# EAGLE design Pointcast_upper_board_V1.02 (EAGLE 7.2.0)
DESIGNER: Rob Oudendijk; VERSION: V1.02
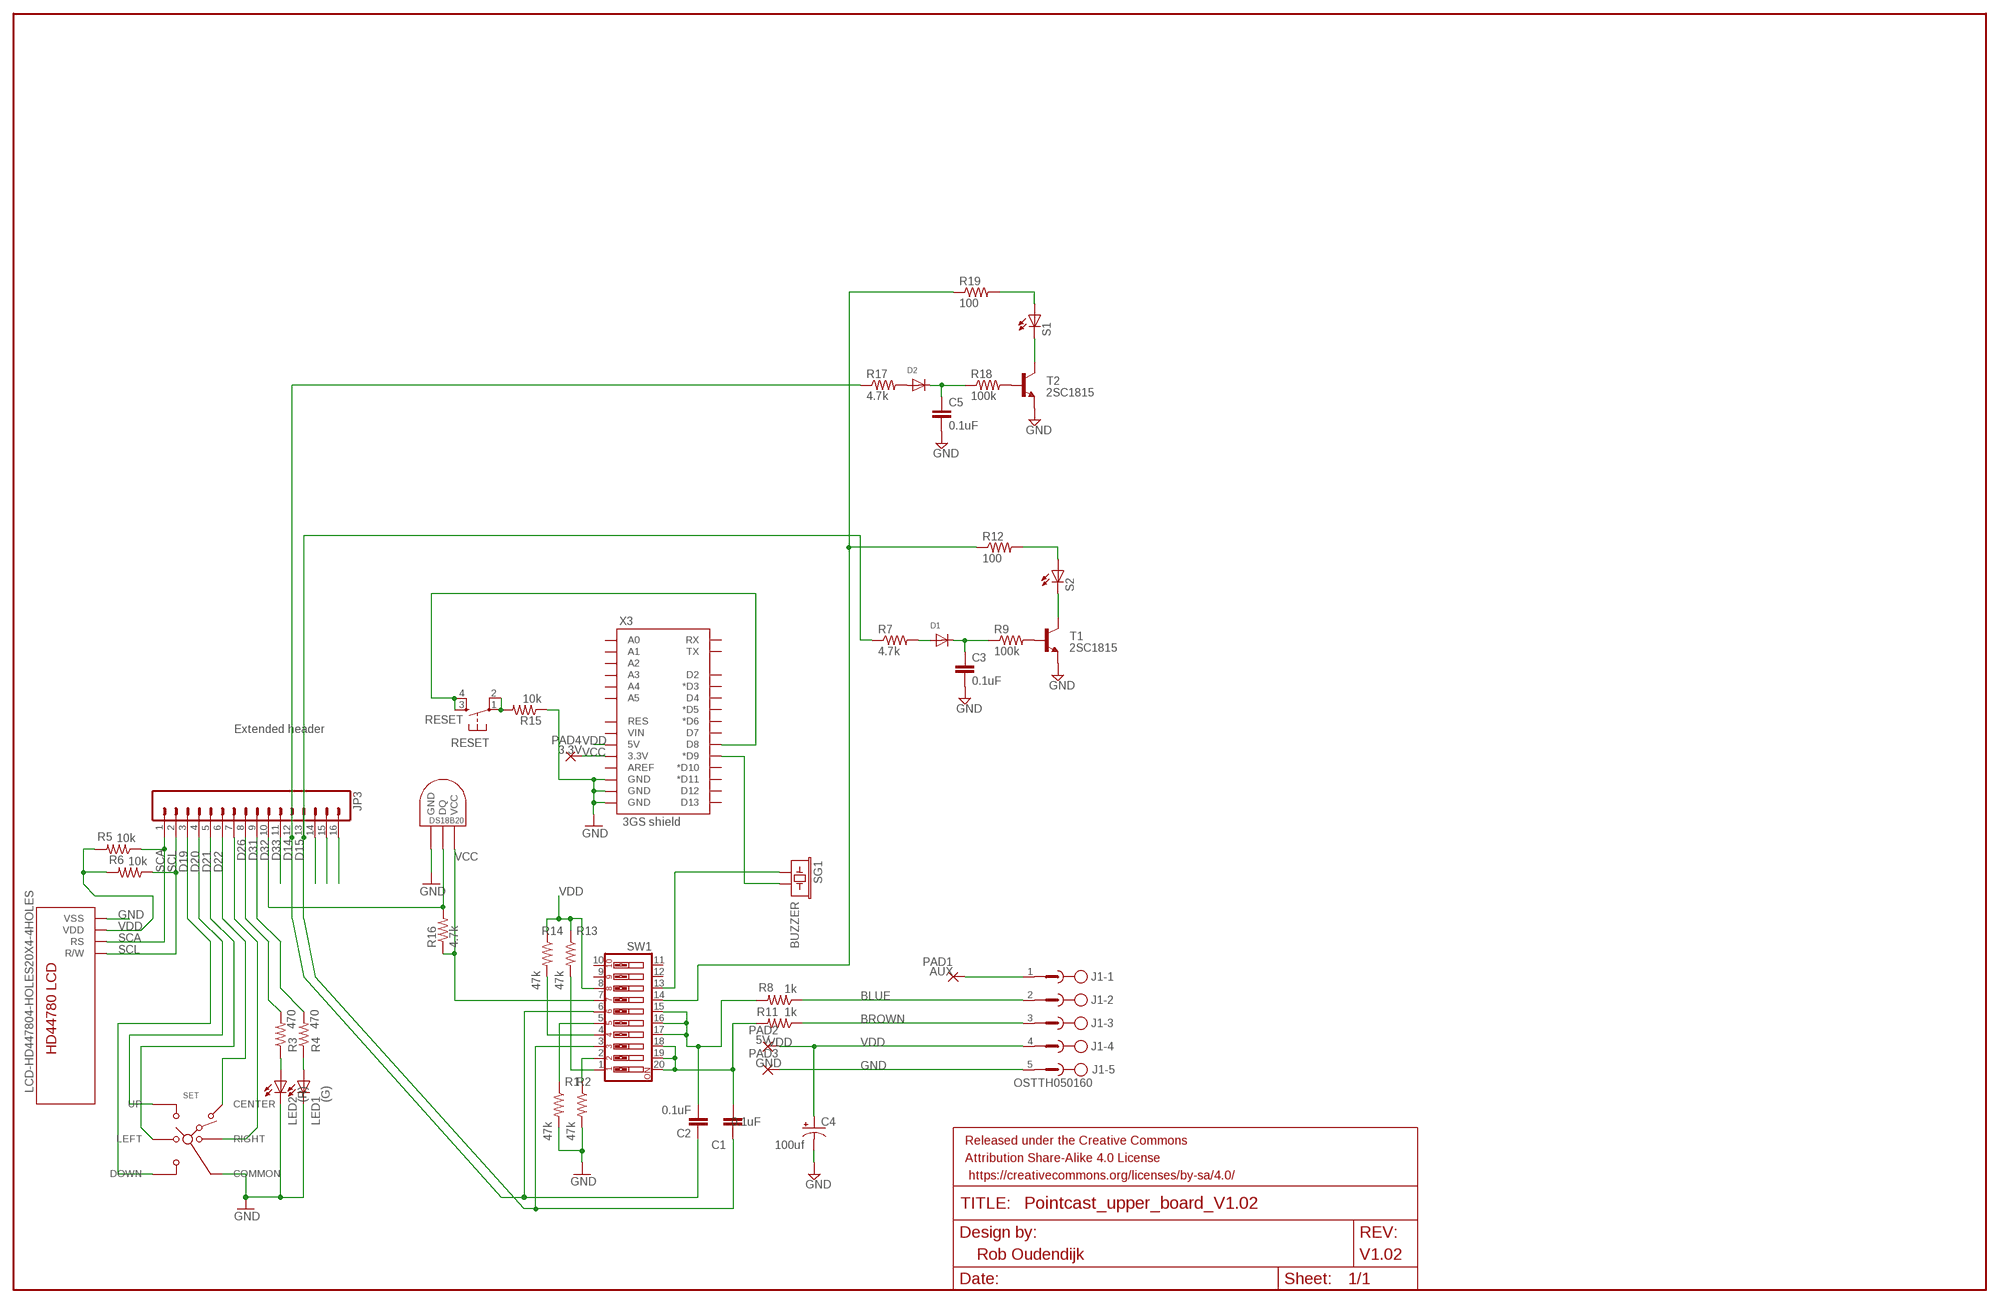
[diagram p0: schematic, sheet 1]

## Parts
C1  0.1uF  C-EU025-024X044  [C025-024X044]
C2  0.1uF  C-EU025-024X044  [C025-024X044]
C3  0.1uF  C-EU025-024X044  [C025-024X044]
C4  100uf  CAP_POLPTH1  [CPOL-RADIAL-100UF-25V]
C5  0.1uF  C-EU025-024X044  [C025-024X044]
D1  DIODEDIODE_BIG  [DO41-10]
D2  DIODEDIODE_BIG  [DO41-10]
FRAME1  FRAME-LEDGER  [CREATIVE_COMMONS]
J1  OSTTH050160  [EDSTL130-05]
JP3  Extended header  M16PTH  [1X16]
LED1  (G)  LED3MM  [LED3MM]
LED2  (R)  LED3MM  [LED3MM]
PAD1  AUX  2,15/1,0  [2,15/1,0]
PAD2  5V  2,15/1,0  [2,15/1,0]
PAD3  GND  2,15/1,0  [2,15/1,0]
PAD4  3.3V  2,15/1,0  [2,15/1,0]
R1  47k  R-US_0207/10  [0207/10]
R2  47k  R-US_0207/10  [0207/10]
R3  470  R-US_0207/10  [0207/10]
R4  470  R-US_0207/10  [0207/10]
R5  10k  R-US_0207/10  [0207/10]
R6  10k  R-US_0207/10  [0207/10]
R7  4.7k  R-US_0207/10  [0207/10]
R8  1k  R-US_0207/10  [0207/10]
R9  100k  R-US_0207/10  [0207/10]
R11  1k  R-US_0207/10  [0207/10]
R12  100  R-US_0207/10  [0207/10]
R13  47k  R-US_0207/10  [0207/10]
R14  47k  R-US_0207/10  [0207/10]
R15  10k  R-US_0207/10  [0207/10]
R16  4.7k  R-US_0207/10  [0207/10]
R17  4.7k  R-US_0207/10  [0207/10]
R18  100k  R-US_0207/10  [0207/10]
R19  100  R-US_0207/10  [0207/10]
RESET  RESET  DTS-6  [DTS-6]
S1  LED3MM  [LED3MM]
S2  LED3MM  [LED3MM]
SET  SKQUCAA010  [SKQU]
SG1  BUZZER  BUZZERPTH  [BUZZER-12MM]
SW1  SW_DIP-10  [EDG-10]
T1  2SC1815  [TO92-ECB]
T2  2SC1815  [TO92-ECB]
TEMP  AVA_DS1820TO92  [AVA_DS1820]
X1  LCD-HD447804-HOLES20X4-4HOLES  [LCD-20X4-4HOLES]
X3  3GS shield  ARDUINO_SHIELDLABEL  [DUEMILANOVE_SHIELD]

## Nets
BLUE: J1.2 R8.1
BROWN: J1.3 R11.1
D14: C2.1 JP3.12 R17.1 SW1.6
D15: C1.1 JP3.13 R7.1 SW1.3
D19: JP3.3 SET.DOWN
D20: JP3.4 SET.UP
D21: JP3.5 SET.LEFT
D22: JP3.6 SET.CENTER
D26: JP3.8 R3.2
D31: JP3.9 R4.2
D32: JP3.10 R16.2 TEMP.DQ
D33: JP3.11
GND [PWP]: C3.2 C4.1(-) C5.2 J1.5 LED1.K(C) LED2.K(C) PAD3.1(P) R1.2 R2.2 R15.1 SET.COMMON T1.E T2.E TEMP.GND X1.P$13(VSS) X3.GND@0(GND) X3.GND@1(GND) X3.GND@2(GND)
N$1: SG1.+ SW1.13
N$2: JP3.14
N$3: LED2.A R3.1
N$4: JP3.15
N$6: R14.2 SW1.4
N$7: R12.1 R19.1 SW1.14
N$8: R2.1 SW1.2
N$9: R1.1 SW1.5
N$10: J1.1 PAD1.1(P)
N$23: SG1.- X3.D9(*D9)
N$39: C1.2 R11.2 SW1.18 SW1.19 SW1.20
N$43: R13.2 SW1.1
N$54: D1.A R7.2
N$58: C3.1 D1.C R9.1
N$62: LED1.A R4.1
N$76: R9.2 T1.B
N$77: S2.K(C) T1.C
N$84: R15.2 RESET.1 RESET.2
N$85: RESET.3 RESET.4 X3.D8
N$92: R12.2 S2.A
N$136: D2.A R17.2
N$137: C5.1 D2.C R18.1
N$138: R18.2 T2.B
N$139: S1.K(C) T2.C
N$140: R19.2 S1.A
N$223: C2.2 R8.2 SW1.15 SW1.16 SW1.17
N$244: JP3.16
S$5: JP3.7 SET.RIGHT
SCA: JP3.1 R5.1 X1.P$15(RS)
SCL: JP3.2 R6.1 X1.P$16(R/W)
VCC [PWP]: PAD4.1(P) R16.1 SW1.7 TEMP.VDD(VCC) X3.3.3V
VDD [PWP]: C4.2(+) J1.4 PAD2.1(P) R5.2 R6.2 R13.1 R14.1 SW1.8 X1.P$14(VDD) X3.5V
Unconnected: SW1.9 SW1.10 SW1.11 SW1.12 X3.A0 X3.A1 X3.A2 X3.A3 X3.A4 X3.A5 X3.AREF X3.D2 X3.D3(*D3) X3.D4 X3.D5(*D5) X3.D6(*D6) X3.D7 X3.D10(*D10) X3.D11(*D11) X3.D12 X3.D13 X3.RES X3.RX X3.TX X3.VIN

## Library data of the parts
C1-C3 C5 = rcl:C-EU: CAPACITOR, European symbol
C4 = SparkFun-Capacitors:CAP_POL: Capacitor Polarized These are standard SMD and PTH capacitors. Normally 10uF, 47uF, and 100uF in electrolytic and tantalum varieties. Always verify the external diameter of the through hole cap, it varies with capacity, voltage, and manufacturer. The EIA devices should be standard.
D1 D2 = adafruit:DIODE: Diode SMADIODE - SMA Surface Mount Package 20V 1A Schottky Diode Digikey: 641-1014-6-ND DO-1N4148 - Through Hole Small Current Diode SOD-123 20V 1 A (.5mV Vf) Schottky Diode - Digikey: MBRX120TPMSCT-ND SOD-323 10V 570mA (.38mV Vf, 3ns) Schottky Diode - Digikey: ZLLS410CT-ND SOD-523 30V 30mA Schottky Diode (RB751S-40TE61) - Digikey: RB751S-40TE61CT-ND SOT23-R/W - SOT23 Package (R = Solder Paste/Reflow Ovens, W = Hand-Soldering) BAT54Film 40V 300mA - Digikey: 497-7162-1-ND
FRAME1 = SparkFun-Aesthetics:FRAME-LEDGER: Schematic Frame Standard 11x14 US Ledger frame
J1 = con-ost:OSTTH050160: 5mm Terminal Header
JP3 = SparkFun-Connectors:M16: 1x16 .1" header
LED1 LED2 S1 S2 = adafruit:LED: LED OSRAM: - CHIPLED LG R971, LG N971, LY N971, LG Q971, LY Q971, LO R971, LY R971 LH N974, LH R974 LS Q976, LO Q976, LY Q976 LO Q996 - Hyper CHIPLED LW Q18S LB Q993, LB Q99A, LB R99A - SideLED LS A670, LO A670, LY A670, LG A670, LP A670 LB A673, LV A673, LT A673, LW A673 LH A674 LY A675 LS A676, LA A676, LO A676, LY A676, LW A676 LS A679, LY A679, LG A679 - Hyper Micro SIDELED® LS Y876, LA Y876, LO Y876, LY Y876 LT Y87S - SmartLED LW L88C, LW L88S LB L89C, LB L89S, LG L890 LS L89K, LO L89K, LY L89K LS L896, LA L896, LO L896, LY L896 - TOPLED LS T670, LO T670, LY T670, LG T670, LP T670 LSG T670, LSP T670, LSY T670, LOP T670, LYG T670 LG T671, LOG T671, LSG T671 LB T673, LV T673, LT T673, LW T673 LH T674 LS T676, LA T676, LO T676, LY T676, LB T676, LH T676, LSB T676, LW T676 LB T67C, LV T67C, LT T67C, LS T67K, LO T67K, LY T67K, LW E67C LS E67B, LA E67B, LO E67B, LY E67B, LB E67C, LV E67C, LT E67C LW T67C LS T679, LY T679, LG T679 LS T770, LO T770, LY T770, LG T770, LP T770 LB T773, LV T773, LT T773, LW T773 LH T774 LS E675, LA E675, LY E675, LS T675 LS T776, LA T776, LO T776, LY T776, LB T776 LHGB T686 LT T68C, LB T68C - Hyper Mini TOPLED® LB M676 - Mini TOPLED Santana® LG M470 LS M47K, LO M47K, LY M47K Source: http://www.osram.convergy.de/
PAD1-PAD4 = wirepad:2,15/1,0: THROUGH-HOLE PAD
R1-R4 R8 R11 R13-R16 = resistor:R-US_: RESISTOR, American symbol
R5 R6 = adafruit:R-US_: RESISTOR, American symbol
R7 R9 R12 R17-R19 = rcl:R-US_: RESISTOR, American symbol
RESET = switch-tact:DTS-6
SET = joy_switch:SKQU: Multi Control Devices TACT Switch - 4-directional with Center Push Type. SKQU Series.; MF: ALPS; OC_ADAFRUIT: 504; OC_MOUSER: 688-SKQUCA; OC_NEWARK: 59M1983
SG1 = SparkFun:BUZZER: Buzzer 12mm Spark Fun Electronics SKU : Comp-Buzzer
SW1 = special:SW_DIP-10: DIP SWITCH
T1 T2 = transistor:2SC1815: NPN EPITAXIAL TRANSISTOR Source: TOSHIBA .. 2SC1815 1.pdf
TEMP = nGeigie_upper_boardTeensy 3Gshield upper board V0.98:AVA_DS1820: DS18B20 Programmable Resolution 1-Wire Digital Thermometer Description The DS18B20 digital thermometer provides 9-bit to 12-bit Celsius temperature measurements and has an alarm function with nonvolatile user-programmable upper and lower trigger points. The DS18B20 communicates over a 1-Wire® bus that by definition requires only one data line (and ground) for communication with a central microprocessor. It has an operating temperature range of -55°C to +125°C and is accurate to ±0.5°C over the range of -10°C to +85°C. In addition, the DS18B20 can derive power directly from the data line ("parasite power"), eliminating the need for an external power supply. Each DS18B20 has a unique 64-bit serial code, which allows multiple DS18B20s to function on the same 1-Wire bus. Thus, it is simple to use one microprocessor to control many DS18B20s distributed over a large area. Applications that can benefit from this feature include HVAC environmental controls, temperature monitoring systems inside buildings, equipment, or machinery, and process monitoring and control systems.
X1 = LCD204_I2C:LCD-HD44780
X3 = SparkFun-Boards:ARDUINO_SHIELD: Arduino shield footprint

## Net classes
0 default: width 0.406 mm, drill 0.254 mm, clearance 0.305 mm
1 PWP: width 0.813 mm, drill 0.254 mm, clearance 0.305 mm

## Board
nGeigie V2.0 Upper board V1.0.0
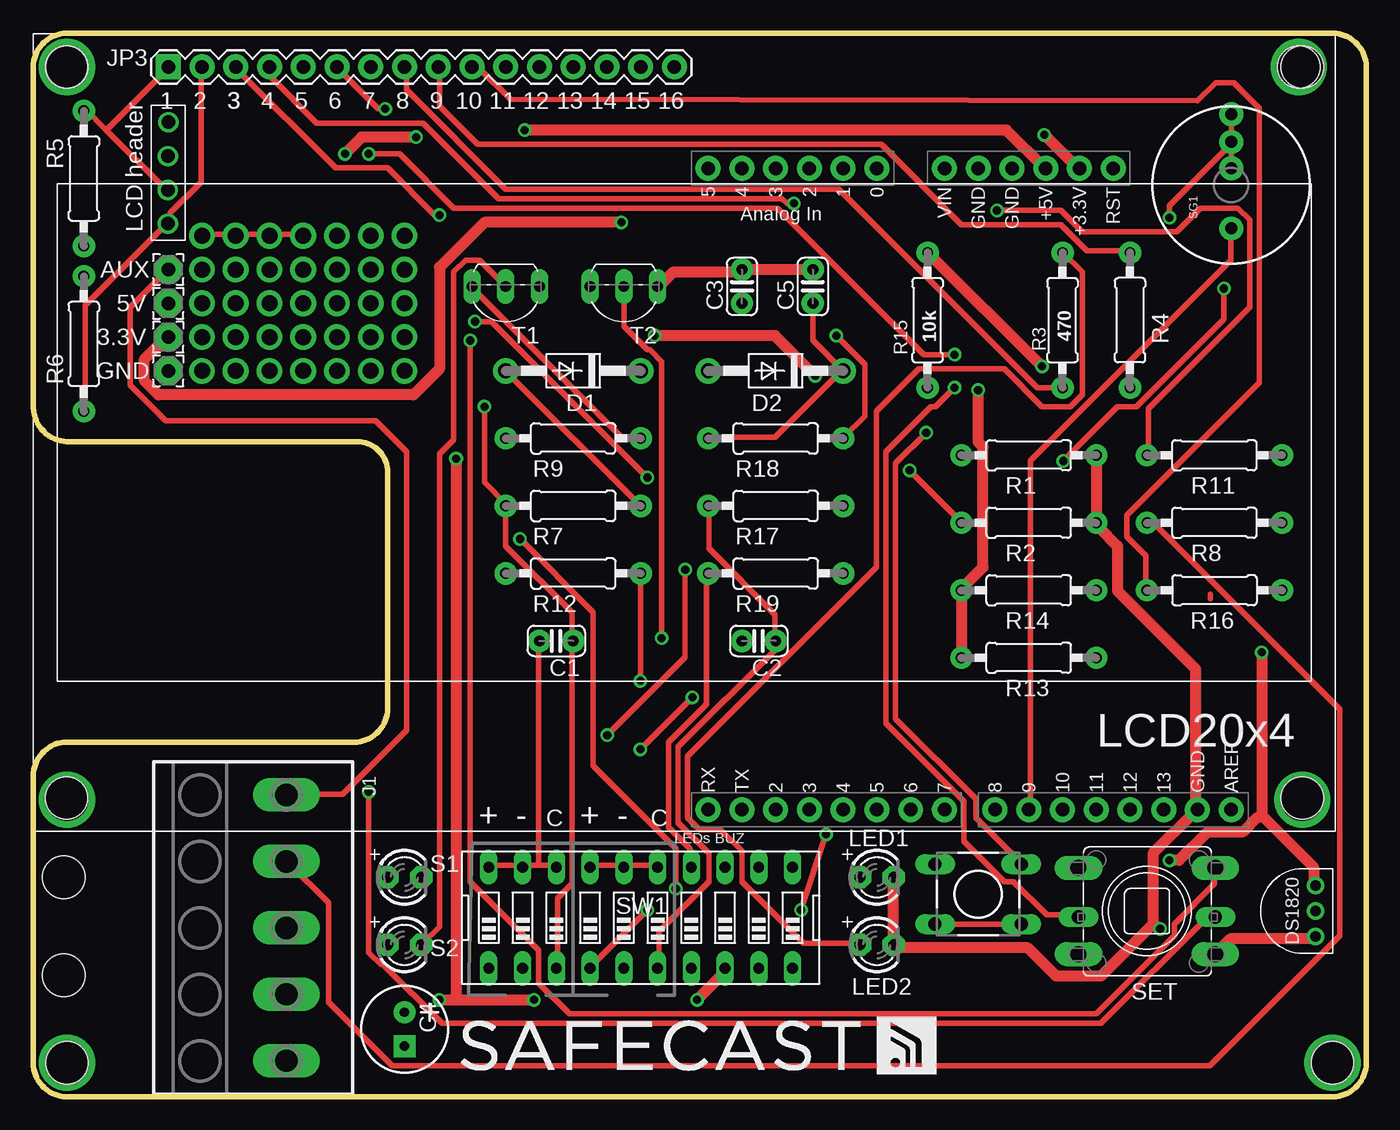
[diagram p1: board, top side]
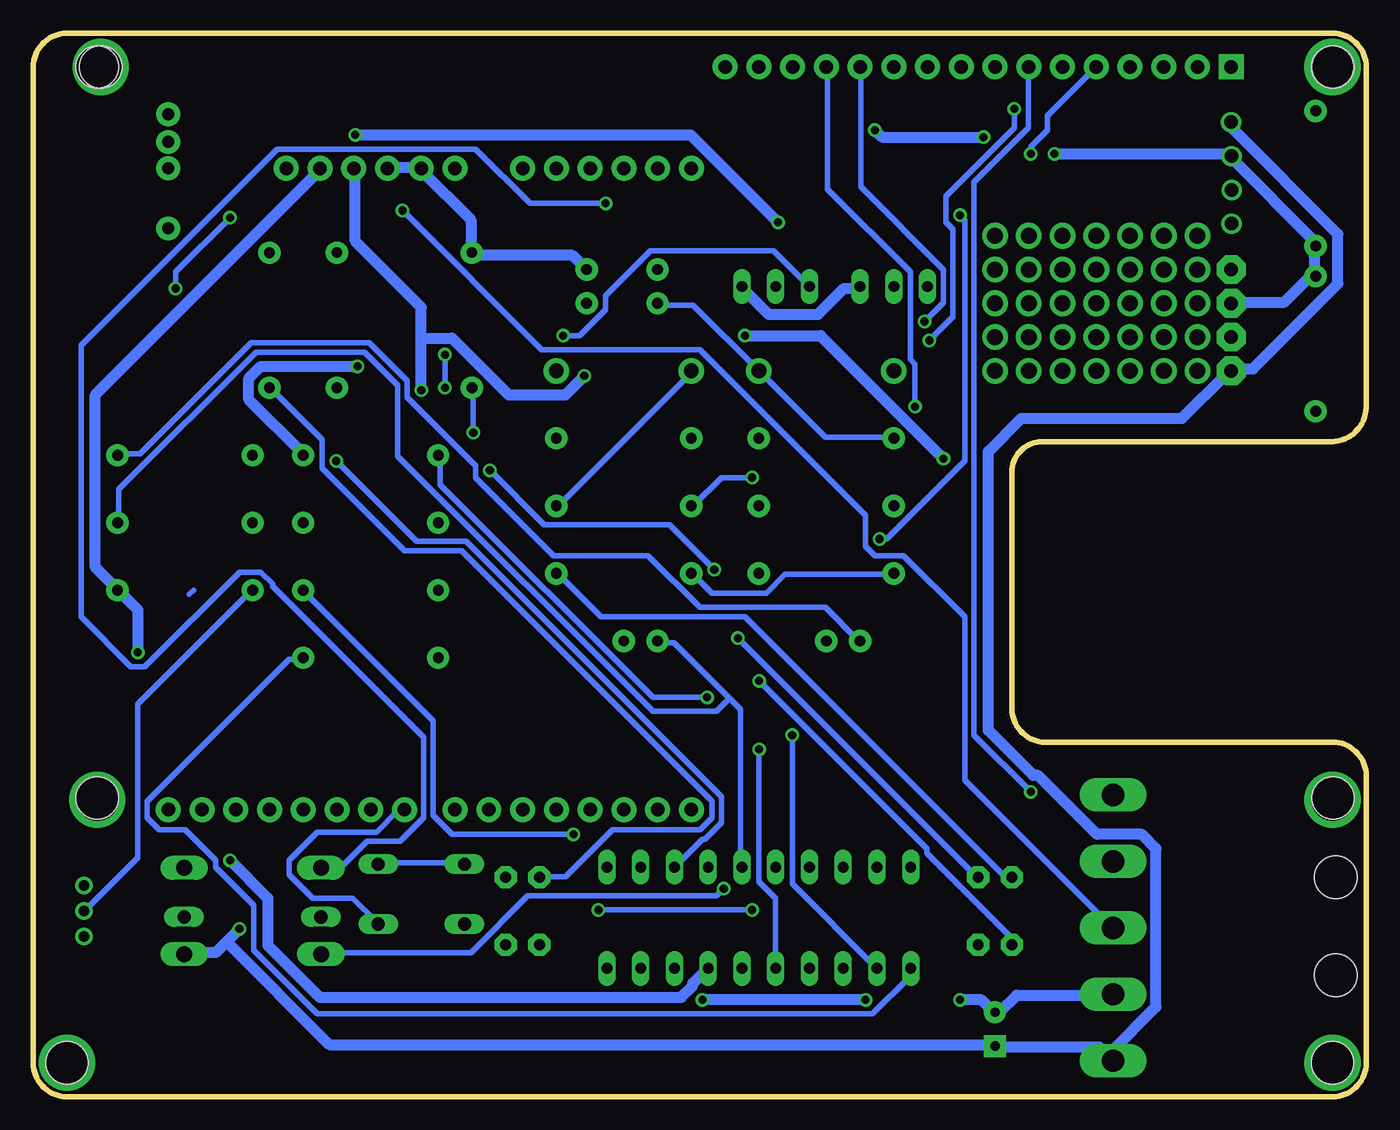
[diagram p2: board, bottom side, seen from below]

Size 100.33 x 80.01 mm. Coordinates in mm from the lower left corner, seen from the top.
Outline: 0,77.47 arc-90 2.54,80.01 97.79,80.01 arc-90 100.33,77.47 100.33,2.54 arc-90 97.79,0 2.54,0 arc-90 0,2.54 0,24.13 arc-90 2.54,26.67 24.13,26.67 arc90 26.67,29.21 26.67,46.99 arc90 24.38,49.28 2.54,49.28 arc-90 0,52.07 0,77.47
Copper layers (1*16): Top 0.035mm / dielectric 1.5mm / Bottom 0.035mm
Design rules "default": minimum track width 10mil, minimum drill 24mil, track to track 8mil, track to pad 8mil, pad to pad 8mil, via to via 8mil, smd to smd 8mil, copper to edge 40mil, drill to drill 8mil, minimum pad ring 10mil, minimum via ring 8mil, stop-mask expansion 4mil, vias tented up to drill 0mil, thermal gap 10mil
Holes 3.2 mm at 2.54,2.54 97.79,2.54 2.54,77.47 95.25,77.47 2.29,9.14 2.29,16.51 2.54,2.54

### Footprints (pad centres in the part's own frame; a part is rotated, then mirrored left to right if it is on the bottom)
C025-024X044 = drill 0.813 pad 1.676: 1 -1.27,0; 2 1.27,0
CPOL-RADIAL-100UF-25V = drill 0.7 pad 1.651 square: 1 -1.27,0 | drill 0.7 pad 1.651: 2 1.27,0
DO41-10 = drill 1.118 pad 1.93: A 5.08,0; C -5.08,0
EDSTL130-05 = drill 1.676 long: 1 -10,0; 2 -5,0; 3 0,0; 4 5,0; 5 10,0
1X16 = drill 1.016 pad 1.88 square: 1 0,0 | drill 1.016 pad 1.88: 2 2.54,0; 3 5.08,0; 4 7.62,0; 5 10.16,0; 6 12.7,0; 7 15.24,0; 8 17.78,0; 9 20.32,0; 10 22.86,0; 11 25.4,0; 12 27.94,0; 13 30.48,0; 14 33.02,0; 15 35.56,0; 16 38.1,0
LED3MM = drill 0.813 pad 1.676 octagon: A -1.27,0; K 1.27,0
2,15/1,0 = drill 1.016 pad 2.159 octagon: 1 0,0
0207/10 = drill 0.8 pad 1.676: 1 -5.08,0 | drill 0.813 pad 1.676: 2 5.08,0
0207/10' = drill 0.813 pad 1.676: 1 -5.08,0; 2 5.08,0
DTS-6 = drill 1 long: 1 -3.25,2.25; 2 3.25,2.25; 3 -3.25,-2.25; 4 3.25,-2.25
SKQU = drill 1.2 long: CENTER 5.15,3.25; COMMON 5.15,-3.25; DOWN -5.15,-3.25; UP -5.15,3.25 | drill 1 long: LEFT -5.15,-0.45; RIGHT 5.15,-0.45
BUZZER-12MM = drill 0.9 pad 1.778: + 3.25,0; - -3.25,0
EDG-10 = drill 0.813 long: 1 -11.43,-3.81; 2 -8.89,-3.81; 3 -6.35,-3.81; 4 -3.81,-3.81; 5 -1.27,-3.81; 6 1.27,-3.81; 7 3.81,-3.81; 8 6.35,-3.81; 9 8.89,-3.81; 10 11.43,-3.81; 11 11.43,3.81; 12 8.89,3.81; 13 6.35,3.81; 14 3.81,3.81; 15 1.27,3.81; 16 -1.27,3.81; 17 -3.81,3.81; 18 -6.35,3.81; 19 -8.89,3.81; 20 -11.43,3.81
TO92-ECB = drill 0.813 long: B 2.54,0; C 0,0; E -2.54,0
AVA_DS1820 = drill 0.8: DQ 2.54,-1.27; GND 0.635,-1.27; VDD 4.445,-1.27
LCD-20X4-4HOLES = drill 1.016: P$13 10.17,53.351; P$14 10.149,50.789; P$15 10.127,48.252; P$16 10.149,45.713 | hole 3.2: 2.5,2.5; 2.5,57.5; 95.5,57.5; 95.5,2.5
DUEMILANOVE_SHIELD = drill 1.016 pad 1.88: 3.3V 12.7,27.94; 5V 10.16,27.94; A0 -2.54,27.94; A1 -5.08,27.94; A2 -7.62,27.94; A3 -10.16,27.94; A4 -12.7,27.94; A5 -15.24,27.94; AREF 24.13,-20.32; D2 -10.16,-20.32; D3 -7.62,-20.32; D4 -5.08,-20.32; D5 -2.54,-20.32; D6 0,-20.32; D7 2.54,-20.32; D8 6.35,-20.32; D9 8.89,-20.32; D10 11.43,-20.32; D11 13.97,-20.32; D12 16.51,-20.32; D13 19.05,-20.32; GND@0 7.62,27.94; GND@1 5.08,27.94; GND@2 21.59,-20.32; RES 15.24,27.94; RX -15.24,-20.32; TX -12.7,-20.32; VIN 2.54,27.94

### Placement (x,y rotation side)
C1  39.37,34.29 180 top
C2  54.61,34.29 180 top
C3  53.34,60.96 90 top
C4  27.94,5.08 90 top
C5  58.67,60.96 90 top
D1  40.64,54.61 180 top
D2  55.88,54.61 180 top
FRAME1  69.85,-3.56 0 top  (outside the outline)
J1  19.05,12.7 270 top
JP3  10.16,77.47 0 top
LED1  63.5,16.51 0 top
LED2  63.5,11.43 0 top
PAD1  10.16,62.23 90 top
PAD2  10.16,59.69 90 top
PAD3  10.16,54.61 90 top
PAD4  10.16,57.15 90 top
R1  74.93,48.26 0 top
R2  74.93,43.18 0 top
R3  77.47,58.42 270 top
R4  82.55,58.42 90 top
R5  10k  [0207/10']  3.81,69.09 270 top
R6  10k  [0207/10']  3.81,56.64 90 top
R7  4.7k  [0207/10']  40.64,44.45 0 top
R8  88.9,43.18 0 top
R9  100k  [0207/10']  40.64,49.53 0 top
R11  88.9,48.26 0 top
R12  100  [0207/10']  40.64,39.37 0 top
R13  74.93,33.02 0 top
R14  74.93,38.1 0 top
R15  67.31,58.42 270 top
R16  88.9,38.1 180 top
R17  4.7k  [0207/10']  55.88,44.45 0 top
R18  100k  [0207/10']  55.88,49.53 0 top
R19  100  [0207/10']  55.88,39.37 0 top
RESET  71.12,15.24 0 top
S1  27.94,16.51 0 top
S2  27.94,11.43 0 top
SET  83.82,13.97 0 top
SG1  90.17,68.58 90 top
SW1  45.72,13.46 0 top
T1  35.56,60.96 180 top
T2  44.45,60.96 180 top
TEMP  95.25,11.43 90 top
U$10  [SAFECAST_LOGO1]  31.75,1.27 0 top
X1  0,19.97 0 top
X3  66.04,41.91 0 top

### Tracks (layer width: path | path; a pad name or v marks a point on that pad's centre or on a via)
BLUE
  Top 0.406: R8.1 83.92,43.03 84.46,43.03 98.32,29.16 98.32,12.09 88.54,2.31 27.03,2.31 22.23,7.11 22.23,14.58 19.2,17.6 J1.2
BROWN  (via drill 0.61)
  Top 0.406: v72.54,66.67 77.34,66.67 78.94,65.08 86.06,65.08 87.83,66.85 90.68,66.85 91.57,65.96 91.57,59.38 83.92,51.74 83.92,48.36 R11.1
  Bottom 0.406: v72.54,66.67 62.05,56.19 50.14,56.19 37.69,43.74 37.69,41.43 36.98,40.72 34.85,40.72 30.23,36.09 30.23,23.82 19.2,12.8 J1.3
D14  (via drill 0.61)
  Top 0.406: SW1.6 47.12,9.78 47.12,12.45 50.85,16.18 50.85,18.31 48.54,20.62 48.54,26.31 55.83,33.6 55.83,34.14 C2.1 55.83,34.31 55.83,36.27 50.85,41.25 50.85,44.45 R17.1 | v33.25,58.32 34.49,58.32 v46.23,46.58
  Bottom 0.406: v33.25,58.32 31.83,59.74 31.83,62.23 38.05,68.45 38.05,77.34 JP3.12 | v46.23,46.58 48.54,46.58 50.67,44.45 R17.1
D15  (via drill 0.61)
  Top 0.406: SW1.3 39.47,9.78 39.47,14.94 40.54,16 40.54,34.14 C1.1 40.54,34.31 40.54,36.45 35.56,41.43 R7.1 35.56,44.63 33.96,46.23 v33.96,51.92
  Bottom 0.406: v33.96,51.92 33.96,55.12 34.32,55.47 34.32,62.05 40.54,68.28 40.54,77.34 JP3.13
D19  (via drill 0.61)
  Top 0.406: v48.36,15.65 48.36,18.67 42.14,24.89 42.14,36.45 v36.63,41.96 | v30.58,66.32 30.23,66.32 26.67,69.88 22.76,69.88 15.29,77.34 JP3.3
  Bottom 0.406: v48.36,15.65 48.9,15.11 63.12,15.11 67.39,10.85 78.59,10.85 SET.DOWN | v36.63,41.96 36.09,41.96 30.23,47.83 30.23,65.96 v30.58,66.32
D20  (via drill 0.61)
  Top 0.406: v57.25,67.21 56.72,67.21 56.36,67.56 35.03,67.56 29.34,73.25 21.34,73.25 17.78,76.81 JP3.4
  Bottom 0.406: v57.25,67.21 62.94,67.21 67.03,71.3 81.97,71.3 96.72,56.54 96.72,36.09 92.99,32.36 91.92,32.36 84.81,39.47 83.21,39.47 82.32,38.58 82.32,38.41 70.94,27.03 70.94,20.98 72.72,19.2 75.21,19.2 77.17,17.25 78.59,17.25 SET.UP
D21  (via drill 0.61)
  Top 0.406: v69.34,53.34 67.92,51.92 67.56,51.92 64.19,48.54 64.19,28.09 70.05,22.23 70.05,19.2 73.08,16.18 73.79,16.18 76.28,13.69 78.59,13.69 SET.LEFT | v69.34,55.83 67.03,55.83 56.01,66.85 31.65,66.85 27.56,70.94 v25.25,70.94
  Bottom 0.406: v69.34,55.83 v69.34,53.34 | v25.25,70.94 25.25,71.48 24,72.72 24,73.79 JP3.5
D22  (via drill 0.61)
  Top 0.406: v32.89,56.9 32.89,16.18 38.05,11.02 38.05,8.53 40.36,6.22 80.01,6.22 85.88,12.09 85.88,12.98 88.9,16 88.9,17.07 SET.CENTER | v26.49,74.32 25.96,74.32 22.94,77.34 JP3.6
  Bottom 0.406: v32.89,56.9 31.12,58.67 31.12,65.25 31.65,65.79 31.65,67.74 26.49,72.9 v26.49,74.32
D26
  Top 0.406: R3.2 75.57,53.34 60.63,68.28 35.56,68.28 28.09,75.74 28.09,77.34 JP3.8
D31
  Top 0.406: R4.2 82.5,63.65 79.3,63.65 77.34,65.61 69.88,65.61 63.83,71.65 33.43,71.65 30.58,74.5 30.58,77.34 JP3.9
D32
  Top 0.406: JP3.10 33.07,77.34 33.6,77.34 35.92,75.03 87.63,74.93 89,76.3 90.35,76.3 92.28,74.37 92.28,53.7 82.32,43.74 82.32,42.14 83.74,40.72 83.74,38.23 R16.2
  Bottom 0.406: TEMP.DQ 96.37,14.05 92.46,17.96 92.46,29.52 83.92,38.05 R16.2
GND  (via drill 0.61)
  Top 0.813: C5.2 C3.2 52.98,62.05 48.18,62.05 47.12,60.98 T2.E | TEMP.GND 96.37,11.91 90.15,11.91 89.08,10.85 SET.COMMON | LED1.K 64.72,16.36 64.72,11.56 LED2.K 65.08,11.2 74.85,11.2 76.99,9.07 80.37,9.07 84.28,12.98 | R1.2 R2.2 80.19,42.85 81.61,41.43 81.61,38.05 87.48,32.18 87.48,21.69 X3.GND@2 87.3,21.34 84.28,18.31 84.28,12.98 | v84.81,12.62 84.63,12.8 84.28,12.98 | v75.92,54.94 67.39,63.48 R15.1
  Bottom 0.813: X3.GND@0 73.61,69.88 71.48,69.88 X3.GND@1 71.12,69.7 67.39,65.96 67.39,63.65 R15.1 67.03,63.3 59.74,63.3 C5.2 | T1.E 38.23,60.81 39.29,60.81 41.25,58.85 44.98,58.85 46.94,60.81 T2.E | v84.81,12.62 85.79,11.65 | 85.79,11.65 86.59,10.85 88.9,10.85 SET.COMMON | 85.79,11.65 78.05,3.91 28.27,3.91 C4.1 27.92,3.73 20.09,3.73 19.2,2.85 J1.5 19.2,3.38 15.82,6.76 15.82,18.67 16.89,19.74 20.27,19.74 24.71,24.18 25.07,24.18 28.45,27.56 28.45,48.54 25.96,51.03 13.87,51.03 10.49,54.41 PAD3.1 9.78,54.76 8.53,54.76 2.13,61.16 2.13,64.9 10.14,72.9 10.14,73.25 X1.P$13 | v75.92,54.94 83.21,54.94 84.1,54.05 84.1,52.45 80.01,48.36 R1.2
N$1  (via drill 0.61)
  Top 0.406: v77.52,47.83 81.61,51.92 83.03,51.92 89.61,58.5 v89.61,60.81 | v85.52,66.14 85.52,67.03 90.15,71.65 SG1.+
  Bottom 0.406: SW1.13 49.96,19.38 49.78,19.38 48.54,20.62 48.54,22.58 67.74,41.78 71.48,41.78 v77.52,47.83 | v89.61,60.81 89.61,62.05 v85.52,66.14
N$3
  Top 0.406: LED2.A 62.23,11.56 57.96,11.56 53.34,16.18 53.34,18.49 51.74,20.09 50.14,20.09 49.25,20.98 49.25,25.6 63.48,39.83 63.48,51.56 66.68,54.76 73.08,54.76 75.92,51.92 78.05,51.92 78.94,52.81 78.94,62.05 77.52,63.48 R3.1
N$5  (via drill 0.9 pad 1.78)
  Top 0.406: v90.17,73.91 90.17,70.1 90.32,70.05 90.32,69.88 v90.17,69.85
N$6  (via drill 0.61)
  Top 0.406: v46.23,14.05 41.96,9.78 SW1.4 | v59.67,19.74 v57.79,14.05
  Bottom 0.406: v57.79,14.05 v46.23,14.05 | v59.67,19.74 68.81,19.74 70.23,21.16 70.23,28.27 80.01,38.05 R14.2
N$7
  Top 0.406: SW1.14 49.43,17.42 49.43,18.67 47.83,20.27 47.83,26.67 50.67,29.52 50.67,39.29 R19.1
  Bottom 0.406: R12.1 35.56,39.29 43.74,39.29 45.16,37.87 49.25,37.87 50.67,39.29 R19.1
N$8  (via drill 0.61)
  Top 0.406: v43.21,27.2 49.07,33.07 v49.07,39.65 | v65.96,47.12 69.88,43.2 R2.1
  Bottom 0.406: v43.21,27.2 43.21,16 36.98,9.78 SW1.2 | v49.07,39.65 52.45,43.03 61.87,43.03 v65.96,47.12
N$9  (via drill 0.61)
  Top 0.406: v49.61,30.05 v45.7,26.14
  Bottom 0.406: SW1.5 44.45,14.94 45.7,16.18 v45.7,26.14 | v49.61,30.05 53.7,30.05 69.7,46.05 69.7,48.18 R1.1
N$10
  Top 0.406: PAD1.1 10.14,62.23 7.29,59.38 7.29,53.52 9.96,50.85 25.78,50.85 28.09,48.54 28.09,27.56 23.29,22.76 19.2,22.76 J1.1
N$11  (via drill 1.2 pad 1.93)
  other vias: 25.4,54.61
N$12  (via drill 3.2 pad 3.81)
  other vias: 2.54,77.47
N$13  (via drill 3.2 pad 3.81)
  other vias: 95.25,77.47
N$14  (via drill 1.2 pad 1.93)
  other vias: 25.4,57.15
N$15  (via drill 1.2 pad 1.93)
  other vias: 27.94,57.15
N$16  (via drill 1.2 pad 1.93)
  other vias: 27.94,54.61
N$17  (via drill 3.2 pad 3.81)
  other vias: 97.79,2.54
N$18  (via drill 3.2 pad 3.81)
  other vias: 2.54,22.35
N$19  (via drill 1.2 pad 1.93)
  other vias: 25.4,62.23
N$20  (via drill 3.2 pad 3.81)
  other vias: 2.54,2.54
N$21  (via drill 3.2 pad 3.81)
  other vias: 95.5,22.35
N$23
  Top 0.406: SG1.- 90.15,65.25 90.15,62.94 75.03,47.83 75.03,21.69 X3.D9
N$25  (via drill 1.2 pad 1.93)
  Top 0.406: v12.7,64.77 12.8,64.9 15.11,64.9 v15.24,64.77 15.29,64.9 17.78,64.9 v17.78,64.77 17.96,64.9 20.27,64.9 v20.32,64.77
N$33  (via drill 1.2 pad 1.93)
  other vias: 25.4,59.69
N$34  (via drill 1.2 pad 1.93)
  other vias: 27.94,59.69
N$35  (via drill 1.2 pad 1.93)
  other vias: 27.94,62.23
N$39
  Top 0.406: SW1.20 34.32,17.42 36.81,17.42 SW1.19 36.98,17.42 38.05,17.42 | 38.05,17.42 39.29,17.42 SW1.18 | 38.05,17.42 38.05,34.14 C1.2
  Bottom 0.406: R11.2 93.88,48.36 92.28,48.36 83.92,56.72 75.03,56.72 72.19,53.87 72.19,52.63 67.03,47.47 67.03,46.58 61.16,40.72 54.05,40.72 50.14,36.8 40.72,36.8 38.23,34.31 C1.2
N$41  (via drill 1.2 pad 1.93)
  other vias: 25.4,64.77
N$43
  Bottom 0.406: SW1.1 34.32,9.6 34.32,9.07 37.16,6.22 78.94,6.22 83.74,11.02 83.74,14.4 86.59,17.25 86.59,17.78 88.9,20.09 90.86,20.09 91.75,20.98 91.75,22.23 81.08,32.89 80.01,32.89 R13.2
N$44  (via drill 1.2 pad 1.93)
  other vias: 22.86,64.77
N$46  (via drill 1.2 pad 1.93)
  other vias: 20.32,54.61
N$47  (via drill 1.2 pad 1.93)
  other vias: 20.32,57.15
N$48  (via drill 1.2 pad 1.93)
  other vias: 22.86,57.15
N$49  (via drill 1.2 pad 1.93)
  other vias: 22.86,54.61
N$51  (via drill 1.2 pad 1.93)
  other vias: 27.94,64.77
N$54
  Top 0.406: R7.2 45.7,44.45 35.56,54.59 D1.A
N$56  (via drill 1.2 pad 1.93)
  other vias: 20.32,62.23
N$58
  Bottom 0.406: R9.1 35.56,49.61 40.72,49.61 D1.C 50.67,59.56 53.34,59.56 C3.1
N$62
  Bottom 0.406: LED1.A 62.23,16.54 60.27,16.54 56.72,20.09 50.14,20.09 49.25,20.98 49.25,22.23 68.1,41.07 72.37,41.07 78.59,47.3 78.59,49.43 82.5,53.34 R4.1
N$75  (via drill 1.2 pad 1.93)
  other vias: 12.7,57.15
N$76
  Top 0.406: T1.B 33.07,60.81 44.27,49.61 45.7,49.61 R9.2
N$77
  Top 0.406: S2.K 30.58,12.8 30.58,48.36 31.65,49.43 31.65,62.05 32.54,62.94 33.6,62.94 35.56,60.98 T1.C
N$80  (via drill 1.2 pad 1.93)
  other vias: 17.78,54.61
N$82  (via drill 1.2 pad 1.93)
  other vias: 12.7,59.69
N$83  (via drill 1.2 pad 1.93)
  other vias: 15.24,59.69
N$84  (via drill 0.61)
  Top 0.406: v67.21,49.96 64.9,47.65 64.9,28.45 70.94,22.4 70.94,20.98 74.32,17.6 RESET.2
  Bottom 0.406: RESET.1 67.92,17.6 74.32,17.6 RESET.2 | v67.21,49.96 67.21,53.34 R15.2
N$85
  Top 0.406: RESET.3 67.92,12.98 74.32,12.98 RESET.4
  Bottom 0.406: X3.D8 72.54,21.51 72.9,21.51 74.5,19.91 78.94,19.91 81.08,17.78 81.08,16.71 79.3,14.94 76.28,14.94 74.5,13.16 RESET.4
N$86  (via drill 1.2 pad 1.93)
  other vias: 15.24,57.15
N$87  (via drill 1.2 pad 1.93)
  other vias: 17.78,59.69
N$92  (via drill 0.61)
  Top 0.406: v45.7,31.29 45.7,39.29 R12.2
  Bottom 0.406: S2.A 26.67,11.91 33.07,18.31 33.07,18.67 v45.7,31.29
N$106  (via drill 1.2 pad 1.93)
  other vias: 17.78,57.15
N$109  (via drill 1.2 pad 1.93)
  other vias: 15.24,54.61
N$111  (via drill 1.2 pad 1.93)
  other vias: 12.7,54.61
N$112  (via drill 1.2 pad 1.93)
  other vias: 20.32,59.69
N$113  (via drill 1.2 pad 1.93)
  other vias: 22.86,59.69
N$136
  Bottom 0.406: R17.2 60.81,44.45 50.67,54.59 D2.A
N$137
  Top 0.406: R18.1 50.85,49.61 55.83,49.61 60.81,54.59 D2.C 58.67,56.9 C5.1
N$138  (via drill 0.61)
  Top 0.406: v60.45,57.25 62.59,55.12 62.59,51.21 60.99,49.61 R18.2
  Bottom 0.406: v60.45,57.25 59.21,57.25 57.25,59.21 57.25,60.27 53.87,63.65 44.63,63.65 41.96,60.98 T2.B
N$139  (via drill 0.61)
  Top 0.406: T2.C 44.45,57.96 46.23,56.19 46.41,56.19 47.3,55.3 v47.3,34.49
  Bottom 0.406: v47.3,34.49 29.34,16.54 S1.K
N$140
  Bottom 0.406: S1.A 26.67,16.54 27.2,16.54 46.76,36.09 57.61,36.09 60.81,39.29 R19.2
N$212  (via drill 1.2 pad 1.93)
  other vias: 17.78,62.23
N$213  (via drill 1.2 pad 1.93)
  other vias: 15.24,62.23
N$214  (via drill 1.2 pad 1.93)
  other vias: 12.7,62.23
N$222  (via drill 1.2 pad 1.93)
  other vias: 22.86,62.23
N$223
  Top 0.406: SW1.17 41.96,17.42 44.45,17.42 SW1.16 44.63,17.42 46.94,17.42 SW1.15
  Bottom 0.406: 47.92,29.96 47.12,29.16 47.12,17.42 SW1.15 | 47.92,29.96 52.1,34.14 53.34,34.14 C2.2 | 47.92,29.96 48.9,28.98 53.7,28.98 72.9,48.18 72.9,53.52 75.39,56.01 83.57,56.01 93.88,45.7 93.88,43.2 R8.2
S$2
  Top 0.406: 88.58,37.78 88.58,37.47
S$3
  Bottom 0.406: 88.27,38.1 88.58,37.78
S$5  (via drill 0.61)
  Top 0.406: v25.25,22.94 25.25,10.85 26.14,9.96 26.31,9.96 30.76,5.51 80.37,5.51 88.37,13.51 88.9,13.51 SET.RIGHT
  Bottom 0.406: 25.43,77.34 JP3.7 25.43,77.17 25.43,72.9 29.52,68.81 29.52,27.2 v25.25,22.94
SCA
  Top 0.406: 5.51,72.72 3.91,74.32 R5.1 | 5.51,72.72 9.96,68.28 X1.P$15 | 5.51,72.72 10.14,77.34 JP3.1
SCL
  Top 0.406: JP3.2 12.62,77.34 12.62,68.81 10.31,66.5 10.31,65.79 X1.P$16 9.96,65.61 3.91,59.56 3.91,51.56 R6.1
VCC  (via drill 0.61)
  Top 0.813: 92.46,21.16 96.37,17.25 96.37,16 TEMP.VDD | v92.46,33.43 92.46,21.16 | v85.52,17.78 86.23,17.78 88.37,19.91 91.03,19.91 92.1,20.98 92.46,21.16 | v44.27,65.79 33.96,65.79 30.58,62.41 30.58,54.76 28.63,52.81 9.42,52.81 8.36,53.87 8.36,55.47 9.25,56.36 9.42,56.36 10.14,57.07 PAD4.1 | v76.1,72.36 78.59,69.88 X3.3.3V
  Bottom 0.813: v92.46,33.43 92.46,36.63 93.88,38.05 R16.1 94.23,38.41 95.66,39.83 95.66,52.81 78.77,69.7 X3.3.3V | v85.52,17.78 82.68,14.94 82.68,11.38 78.77,7.47 51.56,7.47 50.67,8.36 50.67,8.53 49.61,9.6 SW1.7 | v44.27,65.79 50.85,72.36 v76.1,72.36
VDD  (via drill 0.61)
  Top 0.813: v49.96,7.29 51.92,9.25 51.92,9.6 SW1.8 | v30.58,7.29 31.83,7.29 | 31.83,7.29 v37.69,7.29 | R13.1 69.88,33.07 69.88,38.05 R14.1 70.05,38.41 71.48,39.83 71.48,48.9 71.12,49.25 v71.12,53.16 | v31.83,48.01 31.83,7.29 | v46.76,57.25 55.83,57.25 v58.85,54.23 | v23.47,70.94 24.71,72.19 v28.8,72.19 | v36.98,72.72 73.25,72.72 76.1,69.88 X3.5V
  Bottom 0.813: v37.69,7.29 v49.96,7.29 | v30.58,7.29 28.98,7.29 28.09,6.4 C4.2 27.56,6.4 26.31,7.64 19.2,7.64 J1.4 | PAD2.1 10.14,59.74 6.22,59.74 4.27,61.7 R6.2 3.91,61.87 3.91,63.12 R5.2 3.91,64.36 10.14,70.59 X1.P$14 10.49,70.94 v23.47,70.94 | v71.12,53.16 71.12,57.07 | 71.12,57.07 71.12,59.38 76.1,64.36 76.1,69.7 X3.5V | v31.83,48.01 41.07,57.25 v46.76,57.25 | v58.85,54.23 60.27,52.81 64.54,52.81 68.81,57.07 71.12,57.07 | v28.8,72.19 36.45,72.19 v36.98,72.72

### Text on the board
tNames: + | - | C | + | - | C | LEDs | BUZ
tDocu: Thanks to Shuttleworth Foundation, / Medcom and Safecast volunteers | AUX | BRN | S1 | BLU | S2 | WHT | S1 | S2 | Vcc | POINTCAST V2.0 | BLK | GND